# Altium schematic sheet VirtualKeyBoradMouse_2020-04-23_12-54-09.schdoc
size 246 x 184 mm
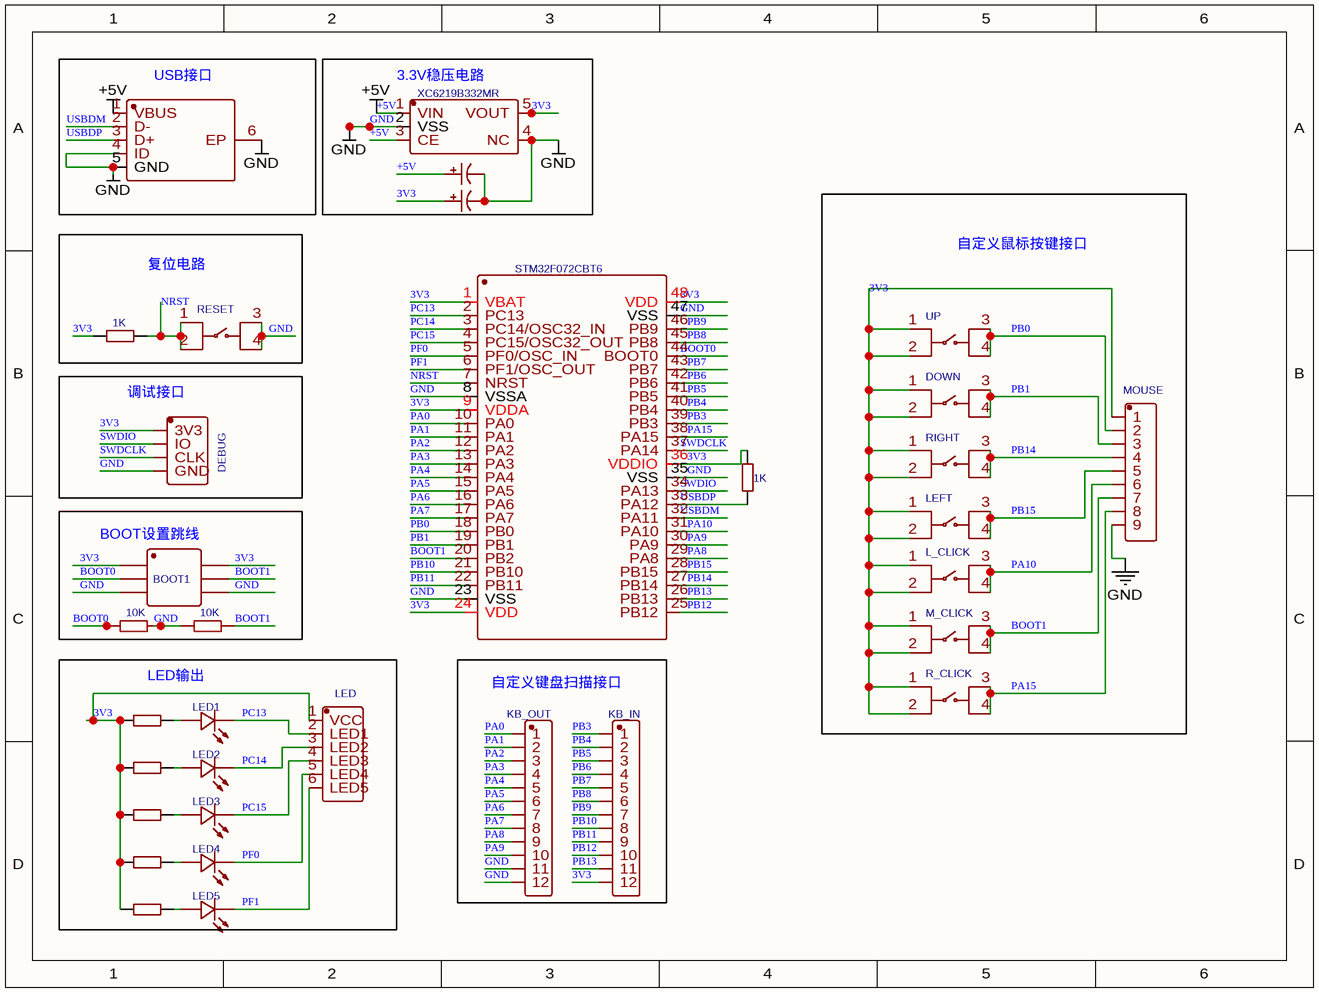
[diagram p0: VirtualKeyBoradMouse_2020-04-23_12-54-09.schdoc]

## Parts
BOOT1  210S-2*3P L=11.6MMGold-plated black  [HDR-TH_6P-P2.54-V-R2-C3-S2.54]  (value not drawn)
C1  100uF  [CAP-SMD_BD5.0-L5.3-W5.3-FD]  (value not drawn)
C2  100uF  [CAP-SMD_BD5.0-L5.3-W5.3-FD]  (value not drawn)
DEBUG  MTP125-1104S1  [HDR-TH_4P-P2.54-V]  (value not drawn)
DOWN  K2-6639SP-C4SC-04  [KEY-SMD_4P-L6.0-W6.0-P3.90-LS10.0]  (value not drawn)
KB_IN  C247920  [HDR-TH_12P-P2.54-H-W10.5]  (value not drawn)
KB_OUT  C247920  [HDR-TH_12P-P2.54-H-W10.5]  (value not drawn)
L_CLICK  K2-6639SP-C4SC-04  [KEY-SMD_4P-L6.0-W6.0-P3.90-LS10.0]  (value not drawn)
LED  210S-1*6P L=11.6MMGold-plated black  [HDR-TH_6P-P2.54-V_Z-211-0611-0021-001]  (value not drawn)
LED1  NCD0603R5  [LED0603-RD]  (value not drawn)
LED2  NCD0603R5  [LED0603-RD]  (value not drawn)
LED3  NCD0603R5  [LED0603-RD]  (value not drawn)
LED4  NCD0603R5  [LED0603-RD]  (value not drawn)
LED5  NCD0603R5  [LED0603-RD]  (value not drawn)
LEFT  K2-6639SP-C4SC-04  [KEY-SMD_4P-L6.0-W6.0-P3.90-LS10.0]  (value not drawn)
M_CLICK  K2-6639SP-C4SC-04  [KEY-SMD_4P-L6.0-W6.0-P3.90-LS10.0]  (value not drawn)
MOUSE  220S-1*9P H=8.5MM Ytype Gold-plated  [HDR-TH_9P-P2.54-V]  (value not drawn)
R1  1K  [R0603]
R2  1K  [R0603]
R3  10K  [R1206]
R4  10K  [R1206]
R5  470  [R0603]  (value not drawn)
R6  470  [R0603]  (value not drawn)
R7  470  [R0603]  (value not drawn)
R8  470  [R0603]  (value not drawn)
R9  470  [R0603]  (value not drawn)
R_CLICK  K2-6639SP-C4SC-04  [KEY-SMD_4P-L6.0-W6.0-P3.90-LS10.0]  (value not drawn)
RESET  K2-6639SP-C4SC-04  [KEY-SMD_4P-L6.0-W6.0-P3.90-LS10.0]  (value not drawn)
RIGHT  K2-6639SP-C4SC-04  [KEY-SMD_4P-L6.0-W6.0-P3.90-LS10.0]  (value not drawn)
U1  STM32F072CBT6  [LQFP-48_L7.0-W7.0-P0.50-LS9.0-TL]
U2  XC6219B332MR  [SOT-23-5_L3.0-W1.7-P0.95-LS2.8-BL]
UP  K2-6639SP-C4SC-04  [KEY-SMD_4P-L6.0-W6.0-P3.90-LS10.0]  (value not drawn)
USB1  67503-1020  [MICRO-USB-SMD_67503-1020]  (value not drawn)

## Blocks framed on the sheet
USB接口: USB1
3.3V稳压电路: C1 C2 U2
自定义鼠标按键接口: DOWN L_CLICK LEFT M_CLICK MOUSE R_CLICK RIGHT UP
复位电路: R2 RESET
调试接口: DEBUG
BOOT设置跳线: BOOT1 R3 R4
LED输出: LED LED1-LED5 R5-R9
自定义键盘扫描接口: KB_IN KB_OUT

## Nets
+5V: C2.1 U2.1(VIN) U2.3(CE) USB1.1(VBUS)
GND: BOOT1.5 BOOT1.6 C1.2 C2.2 DEBUG.4(GND) KB_OUT.11 KB_OUT.12 MOUSE.9 R3.2 R4.1 RESET.3 RESET.4 U1.8(VSSA) U1.23(VSS) U1.35(VSS) U1.47(VSS) U2.2(VSS) U2.4(NC) USB1.4(ID) USB1.5(GND) USB1.6(EP)
3V3: BOOT1.1 BOOT1.2 C1.1 DEBUG.1(3V3) DOWN.1 DOWN.2 KB_IN.12 L_CLICK.1 L_CLICK.2 LED.1(VCC) LEFT.1 LEFT.2 M_CLICK.1 M_CLICK.2 MOUSE.1 R1.2 R2.1 R5.1 R6.1 R7.1 R8.1 R9.1 R_CLICK.1 R_CLICK.2 RIGHT.1 RIGHT.2 U1.1(VBAT) U1.9(VDDA) U1.24(VDD) U1.36(VDDIO) U1.48(VDD) U2.5(VOUT) UP.1 UP.2
BOOT0: BOOT1.3 R3.1 U1.44(BOOT0)
BOOT1: BOOT1.4 M_CLICK.3 M_CLICK.4 MOUSE.7 R4.2 U1.20(PB2)
NRST: R2.2 RESET.1 RESET.2 U1.7(NRST)
PA0: KB_OUT.1 U1.10(PA0)
PA1: KB_OUT.2 U1.11(PA1)
PA2: KB_OUT.3 U1.12(PA2)
PA3: KB_OUT.4 U1.13(PA3)
PA4: KB_OUT.5 U1.14(PA4)
PA5: KB_OUT.6 U1.15(PA5)
PA6: KB_OUT.7 U1.16(PA6)
PA7: KB_OUT.8 U1.17(PA7)
PA8: KB_OUT.9 U1.29(PA8)
PA9: KB_OUT.10 U1.30(PA9)
PA10: L_CLICK.3 L_CLICK.4 MOUSE.6 U1.31(PA10)
PA15: MOUSE.8 R_CLICK.3 R_CLICK.4 U1.38(PA15)
PB0: MOUSE.2 U1.18(PB0) UP.3 UP.4
PB1: DOWN.3 DOWN.4 MOUSE.3 U1.19(PB1)
PB3: KB_IN.1 U1.39(PB3)
PB4: KB_IN.2 U1.40(PB4)
PB5: KB_IN.3 U1.41(PB5)
PB6: KB_IN.4 U1.42(PB6)
PB7: KB_IN.5 U1.43(PB7)
PB8: KB_IN.6 U1.45(PB8)
PB9: KB_IN.7 U1.46(PB9)
PB10: KB_IN.8 U1.21(PB10)
PB11: KB_IN.9 U1.22(PB11)
PB12: KB_IN.10 U1.25(PB12)
PB13: KB_IN.11 U1.26(PB13)
PB14: MOUSE.4 RIGHT.3 RIGHT.4 U1.27(PB14)
PB15: LEFT.3 LEFT.4 MOUSE.5 U1.28(PB15)
PC13: LED.2(LED1) LED1.1(-) U1.2(PC13)
PC14: LED.3(LED2) LED2.1(-) U1.3(PC14/OSC32_IN)
PC15: LED.4(LED3) LED3.1(-) U1.4(PC15/OSC32_OUT)
PF0: LED.5(LED4) LED4.1(-) U1.5(PF0/OSC_IN)
PF1: LED.6(LED5) LED5.1(-) U1.6(PF1/OSC_OUT)
SWDCLK: DEBUG.3(CLK) U1.37(PA14)
SWDIO: DEBUG.2(IO) U1.34(PA13)
USBDM: U1.32(PA11) USB1.2(D-)
USBDP: R1.1 U1.33(PA12) USB1.3(D+)
NetLED1_2: LED1.2(+) R5.2
NetLED2_2: LED2.2(+) R6.2
NetLED3_2: LED3.2(+) R7.2
NetLED4_2: LED4.2(+) R8.2
NetLED5_2: LED5.2(+) R9.2

## Library data of the parts
BOOT1 = 210S-2*3P L=11.6MMGold-plated black: BOM_Manufacturer: Ckmtw; Contributor: LCSC; Package Display: No; BOM_Supplier: LCSC; BOM_Manufacturer Part: 210S-2*3P L=11.6MMGold-plated black; BOM_Supplier Part: C124384; spicePre: H; spiceSymbolName: 210S-2*3P L=11.6MMGold-plated black
C1 C2 = 100uF: BOM_Manufacturer: HONOR; BOM_Manufacturer Part: RVT1A101M0505; nameAlias: Capacitance; Package Display: No; BOM_Supplier: LCSC; BOM_Supplier Part: C3347; spicePre: C; spiceSymbolName: RVT1A101M0505-C3347
DEBUG = MTP125-1104S1: BOM_Manufacturer: MINTRON; Contributor: LCSC; Package Display: No; BOM_Supplier: LCSC; BOM_Supplier Part: C358686; BOM_Manufacturer Part: MTP125-1104S1; spicePre: U; spiceSymbolName: MTP125-1104S1
DOWN L_CLICK LEFT M_CLICK R_CLICK RESET RIGHT UP = K2-6639SP-C4SC-04: BOM_Manufacturer: HRO; Package Display: No; BOM_Supplier: LCSC; BOM_Manufacturer Part: K2-6639SP-C4SC-04; BOM_Supplier Part: C83206; spicePre: S; spiceSymbolName: K2-6639SP-C4SC-04
KB_IN KB_OUT = C247920: BOM_Manufacturer: Boom Precision Elec; Contributor: LCSC; Package Display: No; BOM_Supplier: LCSC; BOM_Supplier Part: C247920; BOM_Manufacturer Part: C247920; spicePre: H; spiceSymbolName: C247920
LED = 210S-1*6P L=11.6MMGold-plated black: BOM_Manufacturer: Ckmtw; Contributor: LCSC; Package Display: No; BOM_Supplier: LCSC; BOM_Manufacturer Part: 210S-1*6P L=11.6MMGold-plated black; BOM_Supplier Part: C124380; spicePre: H; spiceSymbolName: 210S-1*6P L=11.6MMGold-plated black
LED1-LED5 = NCD0603R5: BOM_Manufacturer: Foshan NationStar Optoelectronics; Contributor: LCSC; Package Display: No; BOM_Supplier: LCSC; BOM_Supplier Part: C193902; BOM_Manufacturer Part: NCD0603R5; spicePre: L; spiceSymbolName: NCD0603R5
MOUSE = 220S-1*9P H=8.5MM Ytype Gold-plated: BOM_Manufacturer: Ckmtw; Contributor: LCSC; Package Display: No; BOM_Supplier: LCSC; BOM_Manufacturer Part: 220S-1*9P H=8.5MM Ytype Gold-plated; BOM_Supplier Part: C124417; spicePre: H; spiceSymbolName: 220S-1*9P H=8.5MM Ytype Gold-plated
R1 R2 = 1K: BOM_Manufacturer: UniOhm; BOM_Manufacturer Part: 0603WAF1001T5E; nameAlias: Resistance (Ohms); SMT Type: Basic; Package Display: No; BOM_Supplier: LCSC; BOM_LCSC Assembly: Yes; BOM_Supplier Part: C21190; spicePre: R; spiceSymbolName: 0603WAF1001T5E
R3 R4 = 10K: BOM_Manufacturer: Stackpole Elec; BOM_Manufacturer Part: RMCF1206JT10K0; nameAlias: Resistance (Ohms); Contributor: LCSC; Package Display: No; BOM_Supplier: LCSC; BOM_Supplier Part: C237800; spicePre: R; spiceSymbolName: RMCF1206JT10K0
R5-R9 = 470: BOM_Manufacturer: RALEC; BOM_Manufacturer Part: RTT03471JTP; nameAlias: Resistance (Ohms); Package Display: No; BOM_Supplier: LCSC; BOM_Supplier Part: C103661; spicePre: R; spiceSymbolName: RTT03471JTP
U1 = STM32F072CBT6: BOM_Manufacturer: STMicroelectronics; SMT Type: Extend; Package Display: No; BOM_Supplier: LCSC; BOM_Manufacturer Part: STM32F072CBT6; BOM_Supplier Part: C81720; BOM_LCSC Assembly: Yes; spicePre: U; spiceSymbolName: STM32F072CBT6
U2 = XC6219B332MR: BOM_Manufacturer: TOREX; SMT Type: Extend; Package Display: No; BOM_Supplier: LCSC; BOM_Manufacturer Part: XC6219B332MR; image: //image.lceda.cn/szlcsc/C46517.jpg; BOM_Supplier Part: C46517; BOM_LCSC Assembly: Yes; spicePre: U; spiceSymbolName: XC6219B332MR
USB1 = 67503-1020: BOM_Manufacturer: MOLEX; Contributor: LCSC; Package Display: No; BOM_Supplier: LCSC; BOM_Supplier Part: C136451; BOM_Manufacturer Part: 67503-1020; spicePre: U; spiceSymbolName: 67503-1020